# Altium schematic sheet Overview.SchDoc: Overview
size A4; Revision: A
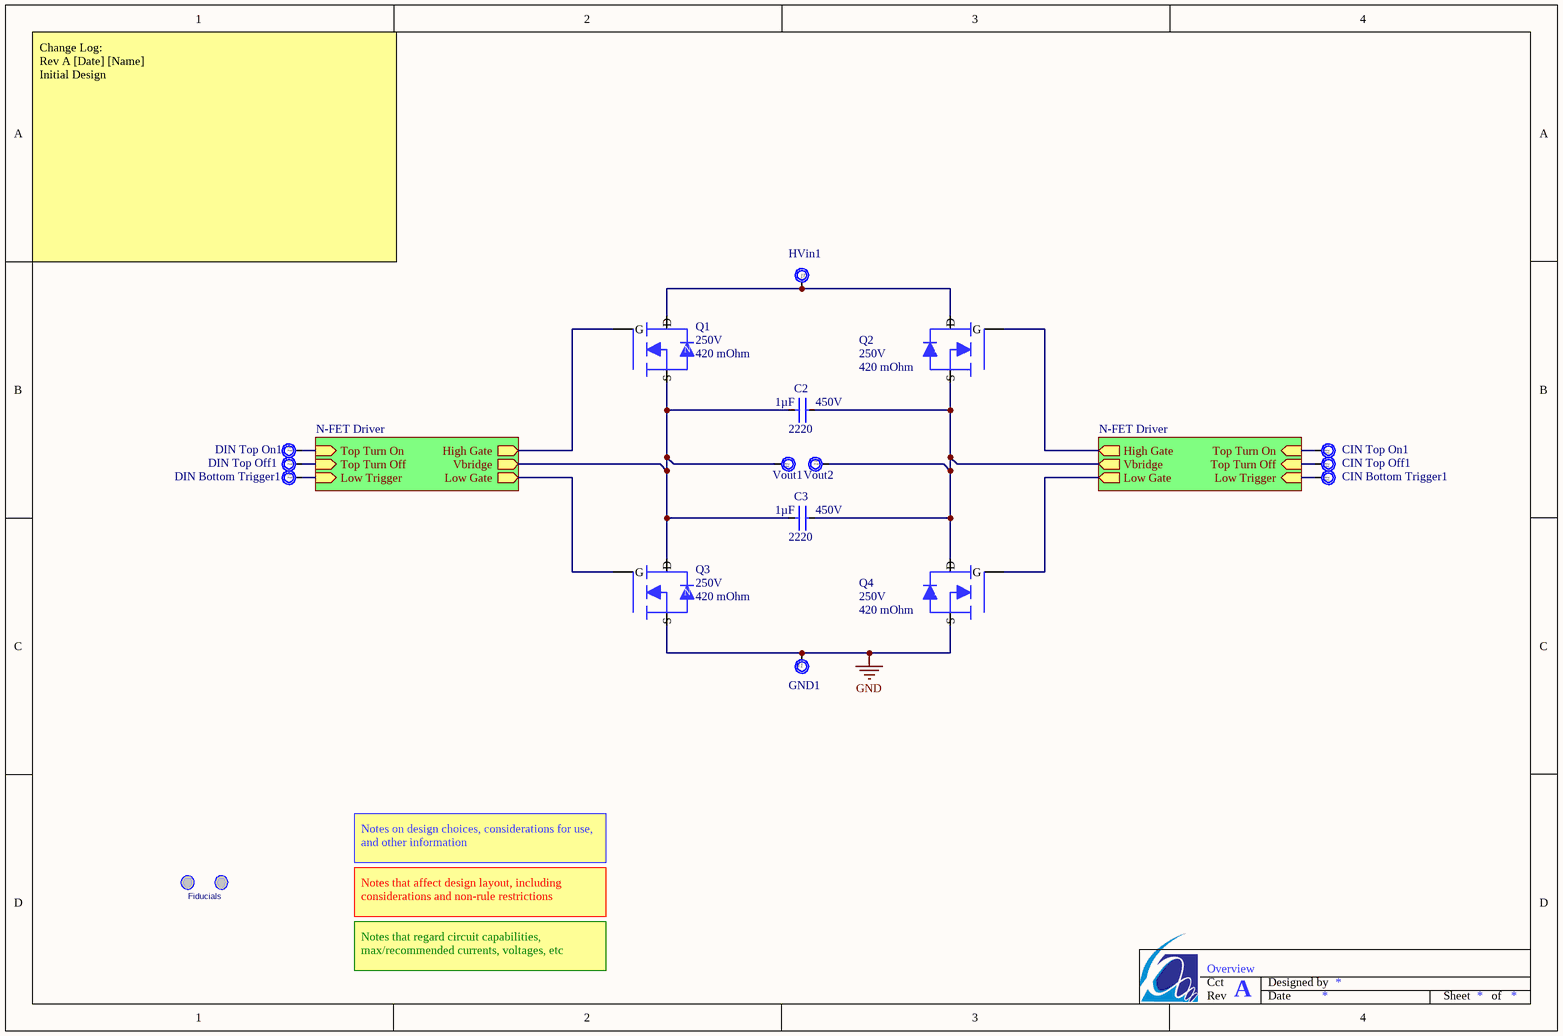
[diagram p0: Overview.SchDoc]

## Parts
C2  Capacitance: 1µF  Voltage - Rated: 450V  Package / Case: 2220  [C2220 - Ceramic]  (hidden comment: 1uF 2220 450V)
C3  Capacitance: 1µF  Voltage - Rated: 450V  Package / Case: 2220  [C2220 - Ceramic]  (hidden comment: 1uF 2220 450V)
CIN_Bottom_Trigger1  Test Point  [Test Pad Large]  (value not drawn)  (no BOM)
CIN_Top_Off1  Test Point  [Test Pad Large]  (value not drawn)  (no BOM)
CIN_Top_On1  Test Point  [Test Pad Large]  (value not drawn)  (no BOM)
DIN_Bottom_Trigger1  Test Point  [Test Pad Large]  (value not drawn)  (no BOM)
DIN_Top_Off1  Test Point  [Test Pad Large]  (value not drawn)  (no BOM)
DIN_Top_On1  Test Point  [Test Pad Large]  (value not drawn)  (no BOM)
FD1  Fiducials  [Fiducial - Top Only]
FD2  Fiducial, Top Only  [Fiducial - Top Only]  (value not drawn)
GND1  Test Point  [Test Pad Large]  (value not drawn)  (no BOM)
HVin1  Test Point  [Test Pad Large]  (value not drawn)  (no BOM)
Q1  Drain to Source Voltage (Vdss): 250V  Rds On (Max) @ Id, Vgs: 420 mOhm  [DPAK]  (hidden comment: N-MOSFET 420mR 250V)
Q2  Drain to Source Voltage (Vdss): 250V  Rds On (Max) @ Id, Vgs: 420 mOhm  [DPAK]  (hidden comment: N-MOSFET 420mR 250V)
Q3  Drain to Source Voltage (Vdss): 250V  Rds On (Max) @ Id, Vgs: 420 mOhm  [DPAK]  (hidden comment: N-MOSFET 420mR 250V)
Q4  Drain to Source Voltage (Vdss): 250V  Rds On (Max) @ Id, Vgs: 420 mOhm  [DPAK]  (hidden comment: N-MOSFET 420mR 250V)
Vout1  Test Point  [Test Pad Large]  (value not drawn)  (no BOM)
Vout2  Test Point  [Test Pad Large]  (value not drawn)  (no BOM)

## Sub-sheets
N-FET Driver = N-FET Driver.SchDoc: Top Turn On (in), Top Turn Off (in), Low Trigger (in), High Gate (out), Vbridge (out), Low Gate (out)
N-FET Driver = N-FET Driver.SchDoc: Top Turn On (in), Top Turn Off (in), Low Trigger (in), High Gate (out), Vbridge (out), Low Gate (out)

## Nets
GND: GND1.1 Q3.3(S) Q4.3(S)
NetC2_1: C2.1 C3.1 Q1.3(S) Q3.2(D) Vout1.1 ; sheet N-FET Driver/Vbridge
NetC2_2: C2.2 C3.2 Q2.3(S) Q4.2(D) Vout2.1 ; sheet N-FET Driver/Vbridge
NetCIN_Bottom_Trigger1_1: CIN_Bottom_Trigger1.1 ; sheet N-FET Driver/Low Trigger
NetCIN_Top_Off1_1: CIN_Top_Off1.1 ; sheet N-FET Driver/Top Turn Off
NetCIN_Top_On1_1: CIN_Top_On1.1 ; sheet N-FET Driver/Top Turn On
NetDIN_Bottom_Trigger1_1: DIN_Bottom_Trigger1.1 ; sheet N-FET Driver/Low Trigger
NetDIN_Top_Off1_1: DIN_Top_Off1.1 ; sheet N-FET Driver/Top Turn Off
NetDIN_Top_On1_1: DIN_Top_On1.1 ; sheet N-FET Driver/Top Turn On
NetHVin1_1: HVin1.1 Q1.2(D) Q2.2(D)
NetQ1_1: Q1.1(G) ; sheet N-FET Driver/High Gate
NetQ2_1: Q2.1(G) ; sheet N-FET Driver/High Gate
NetQ3_1: Q3.1(G) ; sheet N-FET Driver/Low Gate
NetQ4_1: Q4.1(G) ; sheet N-FET Driver/Low Gate

## Notes on the sheet
- Change Log:
  Rev A	[Date]	[Name]
  Initial Design
- Notes on design choices, considerations for use, and other information
- Notes that affect design layout, including considerations and non-rule restrictions
- Notes that regard circuit capabilities, max/recommended currents, voltages, etc
- Cct
- Designed by
- Rev
- Date
- Sheet       of
- (in symbol N-MOSFET 420mR 250V) N
- (in symbol Test Point) Test; Point

## Library data of the parts
C2 C3 = 1uF 2220 450V: Manufacturer: TDK Corporation; Manufacturer Part Number: CGA9P4X7T2W105M250KE; Tolerance: ±20%; Temperature Coefficient: X7T; Supplier 1: Digi-Key; Supplier Part Number 1: 445-7998-1-ND; RoHS: RoHS Compliant; Category: Capacitors; Stock 1: 10247; Pricing 1: 1=3.11, 10=2.576, 100=2.1589, 250=1.78012 (USD); Packaging: Cut Tape (CT); Part Status: Active; Operating Temperature: -55°C ~ 125°C; Features: Soft Termination; Ratings: AEC-Q200; Applications: Automotive, Boardflex Sensitive; Failure Rate: -; Mounting Type: Surface Mount, MLCC; Size / Dimension: 0.224" L x 0.197" W (5.70mm x 5.00mm); Height - Seated (Max): -; Thickness (Max): 0.098" (2.50mm); Lead Spacing: -; Lead Style: -; ComponentLink1URL: https://product.tdk.com/info/en/catalog/datasheets/mlcc_automotive_soft_en.pdf; ComponentLink1Description: Spec Sheet; Value: 1uF 2220 450V
FD1 = Fiducial, Top Only: Technology: Mechanical
Q1-Q4 = N-MOSFET 420mR 250V: Manufacturer: Fairchild/ON Semiconductor; Manufacturer Part Number: FQD9N25TM; FET Type: N-Channel; Current - Continuous Drain (Id) @ 25°C: 7.4A (Tc); Drive Voltage (Max Rds On,  Min Rds On): 10V; Vgs(th) (Max) @ Id: 5V @ 250µA; Gate Charge (Qg) (Max) @ Vgs: 20nC @ 10V; Input Capacitance (Ciss) (Max) @ Vds: 700pF @ 25V; Vgs (Max): ±30V; Power Dissipation (Max): 2.5W (Ta), 55W (Tc); Supplier 1: Digi-Key; Supplier Part Number 1: FQD9N25TMCT-ND; RoHS: RoHS Compliant; Category: Discrete Semiconductor Products; Stock 1: 4941; Pricing 1: 1=0.86, 10=0.766, 100=0.597, 500=0.49316, 1000=0.38934 (USD); Packaging: Cut Tape (CT); Part Status: Active; Technology: MOSFET (Metal Oxide); FET Feature: -; Operating Temperature: -55°C ~ 150°C (TJ); Mounting Type: Surface Mount; Supplier Device Package: D-Pak; Package / Case: TO-252-3, DPak (2 Leads + Tab), SC-63; ComponentLink1URL: https://www.fairchildsemi.com/datasheets/FQ/FQD9N25.pdf; ComponentLink1Description: Spec Sheet
FD2 = Fiducial, Top Only: Technology: Mechanical